# EAGLE design Adafruit EYESPI 1.44 inch TFT Breakout (EAGLE 9.6.2)
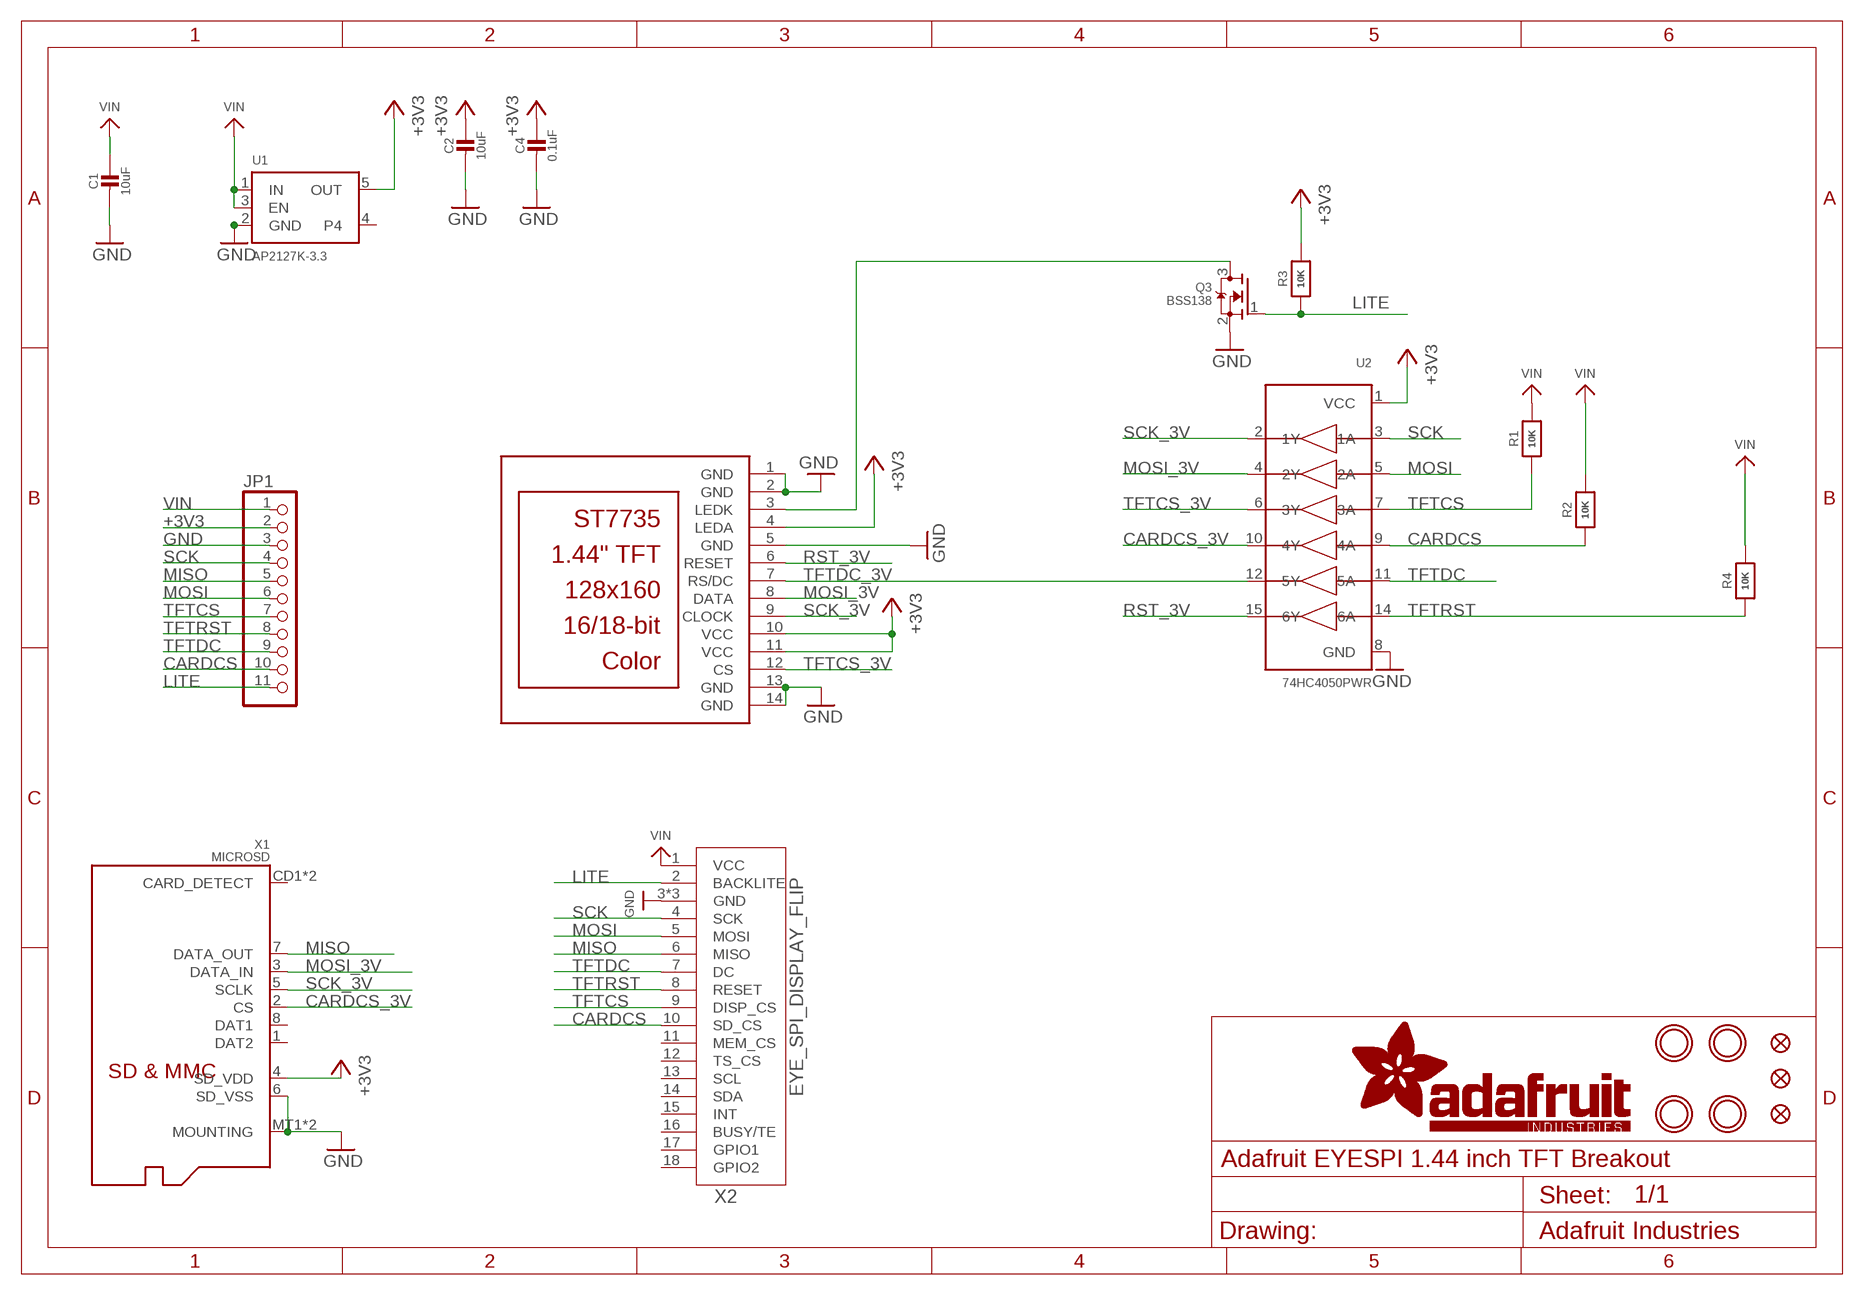
[diagram p0: schematic, sheet 1]

## Parts
C1  10uF  CAP_CERAMIC0805-NOOUTLINE  [0805-NO]
C2  10uF  CAP_CERAMIC0805-NOOUTLINE  [0805-NO]
C4  0.1uF  CAP_CERAMIC0603_NO  [0603-NO]
JP1  HEADER-1X1176MIL  [1X11_ROUND_76]
Q3  BSS138  MOSFET-NWIDE  [SOT23-WIDE]
R1  10K  RESISTOR_0603_NOOUT  [0603-NO]
R2  10K  RESISTOR_0603_NOOUT  [0603-NO]
R3  10K  RESISTOR_0603_NOOUT  [0603-NO]
R4  10K  RESISTOR_0603_NOOUT  [0603-NO]
TFT2  DISP_LCD_ST7735_1.44IN  [TFT_1.44IN_128_128]
U1  AP2127K-3.3  VREG_SOT23-5  [SOT23-5]
U2  74HC4050PWR  74HC4050DTSSOP  [TSSOP16]
U$3  FIDUCIAL_1MM  [FIDUCIAL_1MM]
U$4  FIDUCIAL_1MM  [FIDUCIAL_1MM]
U$5  FIDUCIAL_1MM  [FIDUCIAL_1MM]
U$7  MOUNTINGHOLE2.5  [MOUNTINGHOLE_2.5_PLATED]
U$8  MOUNTINGHOLE2.5  [MOUNTINGHOLE_2.5_PLATED]
U$9  MOUNTINGHOLE2.5  [MOUNTINGHOLE_2.5_PLATED]
U$10  MOUNTINGHOLE2.5  [MOUNTINGHOLE_2.5_PLATED]
X1  MICROSD  [MICROSD]
X2  EYE_SPI_DISPLAY_FLIP  [EYE_SPI_DISPLAY_BOTCONTACT]

## Nets
+3V3 [power]: C2.1 C4.1 JP1.2 R3.2 TFT2.4(LEDA) TFT2.10(VCC) TFT2.11(VCC) U1.5(OUT) U2.1(VCC) X1.4(SD_VDD)
CARDCS: JP1.10 R2.1 U2.9(4A) X2.10(SD_CS)
CARDCS_3V: U2.10(4Y) X1.2(CS)
GND: C1.2 C2.2 C4.2 JP1.3 Q3.2(S) TFT2.1(GND) TFT2.2(GND) TFT2.5(GND) TFT2.13(GND) TFT2.14(GND) U1.2(GND) U2.8(GND) X1.6(SD_VSS) X1.MT1(MOUNTING) X1.MT2(MOUNTING) X2.3(GND) X2.SUPPORT1(GND) X2.SUPPORT2(GND)
LITE: JP1.11 Q3.1(G) R3.1 X2.2(BACKLITE)
MISO: JP1.5 X1.7(DATA_OUT) X2.6(MISO)
MOSI: JP1.6 U2.5(2A) X2.5(MOSI)
MOSI_3V: TFT2.8(DATA) U2.4(2Y) X1.3(DATA_IN)
N$5: Q3.3(D) TFT2.3(LEDK)
RST_3V: TFT2.6(RESET) U2.15(6Y)
SCK: JP1.4 U2.3(1A) X2.4(SCK)
SCK_3V: TFT2.9(CLOCK) U2.2(1Y) X1.5(SCLK)
TFTCS: JP1.7 R1.1 U2.7(3A) X2.9(DISP_CS)
TFTCS_3V: TFT2.12(CS) U2.6(3Y)
TFTDC: JP1.9 U2.11(5A) X2.7(DC)
TFTDC_3V: TFT2.7(RS/DC) U2.12(5Y)
TFTRST: JP1.8 R4.1 U2.14(6A) X2.8(RESET)
VIN [power]: C1.1 JP1.1 R1.2 R2.2 R4.2 U1.1(IN) U1.3(EN) X2.1(VCC)
Unconnected: U1.4 X1.1(DAT2) X1.8(DAT1) X1.CD1(CARD_DETECT) X1.CD2(CARD_DETECT) X2.11(MEM_CS) X2.12(TS_CS) X2.13(SCL) X2.14(SDA) X2.15(INT) X2.16(BUSY/TE) X2.17(GPIO1) X2.18(GPIO2)

## Library data of the parts
C1 C2 C4 = microbuilder:CAP_CERAMIC: Ceramic Capacitors For new designs, use the packages preceded by an '_' character since they are more reliable: The following footprints should be used on most boards: _0402 - Standard footprint for regular board layouts _0603 - Standard footprint for regular board layouts _0805 - Standard footprint for regular board layouts _1206 - Standard footprint for regular board layouts For extremely tight-pitch boards where space is at a premium, the following 'micro-pitch' footprints can be used (smaller pads, no silkscreen outline, etc.): _0402MP - Micro-pitch footprint for very dense/compact boards _0603MP - Micro-pitch footprint for very dense/compact boards _0805MP - Micro-pitch footprint for very dense/compact boards _1206MP - Micro-pitch footprint for very dense/compact boards
JP1 = microbuilder:HEADER-1X11
Q3 = microbuilder:MOSFET-N: N-Channel Mosfet LEGEND VDS: Voltage Drain-Source ID: Drain Current RDS(ON): Drain-Source On-State Resistance VGS(TH): Gate-Source Threshold Voltage CISS: Drain-Source Input Capacitance SOT-23 Name VDS ID RDS(ON) VGS(TH) CISS Order Number 2N7002E 60V 260mA 2.5 Ohm 2.5V @ 250uA 26.7pF @ 25V 2N7002ET1GOSTR-ND BSH103 30V 850mA 400 mOhm 400mV @ 1mA 83pF @ 24V BSH103,235-ND BSS138 60V 320mA 1.6 Ohm 1.5V @ 250uA 50pF @ 10V Mouser: 771-BSS138PW115 DMN2075U-7 20V 4.2A 38 mOhm 1V @ 250 uA 594.3pF @ 10V DMN2075U-7DICT-ND * BSS138 good choice for I2C level-shifting POWERPAK 1212-8 Name VDS ID RDS(ON) VGS(TH) CISS Order Number Si7308DN 60V 6A 58 mOhm 3V @ 250uA 665pF @ 15V SI7308DN-T1-E3CT-ND
R1-R4 = microbuilder:RESISTOR: Resistors For new designs, use the packages preceded by an '_' character since they are more reliable: The following footprints should be used on most boards: _0402 - Standard footprint for regular board layouts _0603 - Standard footprint for regular board layouts _0805 - Standard footprint for regular board layouts _1206 - Standard footprint for regular board layouts For extremely tight-pitch boards where space is at a premium, the following 'micro-pitch' footprints can be used (smaller pads, no silkscreen outline, etc.): _0402MP - Micro-pitch footprint for very dense/compact boards _0603MP - Micro-pitch footprint for very dense/compact boards _0805MP - Micro-pitch footprint for very dense/compact boards _1206MP - Micro-pitch footprint for very dense/compact boards
TFT2 = adafruit_display:DISP_LCD_ST7735_1.44IN
U1 = adafruit_power:VREG_SOT23-5: SOT23-5 Fixed Voltage Regulators Part Current Out V Out V In V Dropout θJA (°C/W) TJ (°C) Digikey Part No. ADP121 150mA 3.3V 3.4-5.5V 0.09V @ 150mA -- -- ADP121-AUJZ33R7CT-ND ADP121 150mA 3.0V 3.1-5.5V 0.09V @ 150mA -- -- ADP121-AUJZ30R7CT-ND ADP122 300mA 3.3V 3.4-5.5V 0.085V @ 300mA -- -- ADP122AUJZ-3.3-R7CT-ND ADP1712 300mA 3.3V 3.5-5.5V 0.17V @ 300mA -- -- ADP1712AUJZ-3.3-R7TR-ND AP7311 (Low Cost) 150mA 3.3V 3.5-6V 0.15V @ 150mA -- -- AP7311-33WG-7DICT-ND LD39015M18R 150mA 1.8V 1.9V-5.5V 0.08V @ 100mA -- -- 497-6977-1-ND LP2985A-33DBVR 150mA 3.3V 3.3-16V 0.28V @ 150mA 206 150 296-18479-1-ND MCP1824T-3302E/OT 300mA 3.3V 3.5V-6V 0.2V @ 300mA -- -- MCP1824T-3302E/OTCT-ND MIC5205-2.5YM5 TR 150mA 2.5V 2.7-16V 0.165V @ 150mA -- -- 576-1257-2-ND MIC5205-3.0YM5 TR 150mA 3.0V 3.2V-16V 0.165V @ 150mA -- -- 576-1258-2-ND MIC5205-3.3YM5 TR 150mA 3.3V 3.5V-16V 0.165V @ 150mA -- -- 576-1259-2-ND TPS780330220 150mA 3.3V+2.2V 3.6-5.5V 250mV Max -- -- 296-23332-1-ND TDA3663/N1,135 100mA 3.3V 3.5-45V 0.18V @ 50mA -- -- 568-5343-1-ND Max operating temp can be calculated using θJA, TJ (max junction temperature), and power in watts. Set the "Maximum Ambient Temperature" until it reaches TJ ("Max Junction Temperature"), which is the absolute limit for safe use of the regulator: Heat Sink Temperature Calculator <http://www.daycounter.com/Calculators/Heat-Sink-Temperature-Calculator.phtml> For example, With 12V source into a 3.3V LP2985 and a 30mA load, we are dissipating (12V-3.3V) * 0.03A = 0.261W. With a θJA of 206 °C/W, a TJ of 150°C, and 261mW we can safely use the chip without a heat sink up to 75°C (=147.1°C Junction Temperature).; JLC_ROTATION: 270
U2 = microbuilder:74HC4050D: 6-channel level shifter 74HC4050D - 2V-6V Supply SOIC16 Digikey: 74HC4050D,653-ND Mouser: 771-74HC4050D-T TSSOP16 Digikey: 296-9215-1-ND Mouser:
U$3-U$5 = microbuilder:FIDUCIAL: Fiducial Alignment Points Various fiducial points for machine vision alignment.; BOM: EXCLUDE
U$7-U$10 = adafruit_electromech:MOUNTINGHOLE: Mounting Hole For #2 screws (0.086"/2.18mm width, 0.094"/2.4mm hole) use 2.5mm; BOM: EXCLUDE
X1 = adafruit_electromech:MICROSD: MicroSD/Transflash Card Holder with SPI pinout 3M: 2908-05WB-MG 4UConnector: 19656 Footprint courtesy: Adafruit Industries; JLC_ROTATION: 90; LCSC: C125617
X2 = adafruit_display:EYE_SPI_DISPLAY; LCSC: C2856802

## Net classes
1 power: width 0.254 mm

## Board
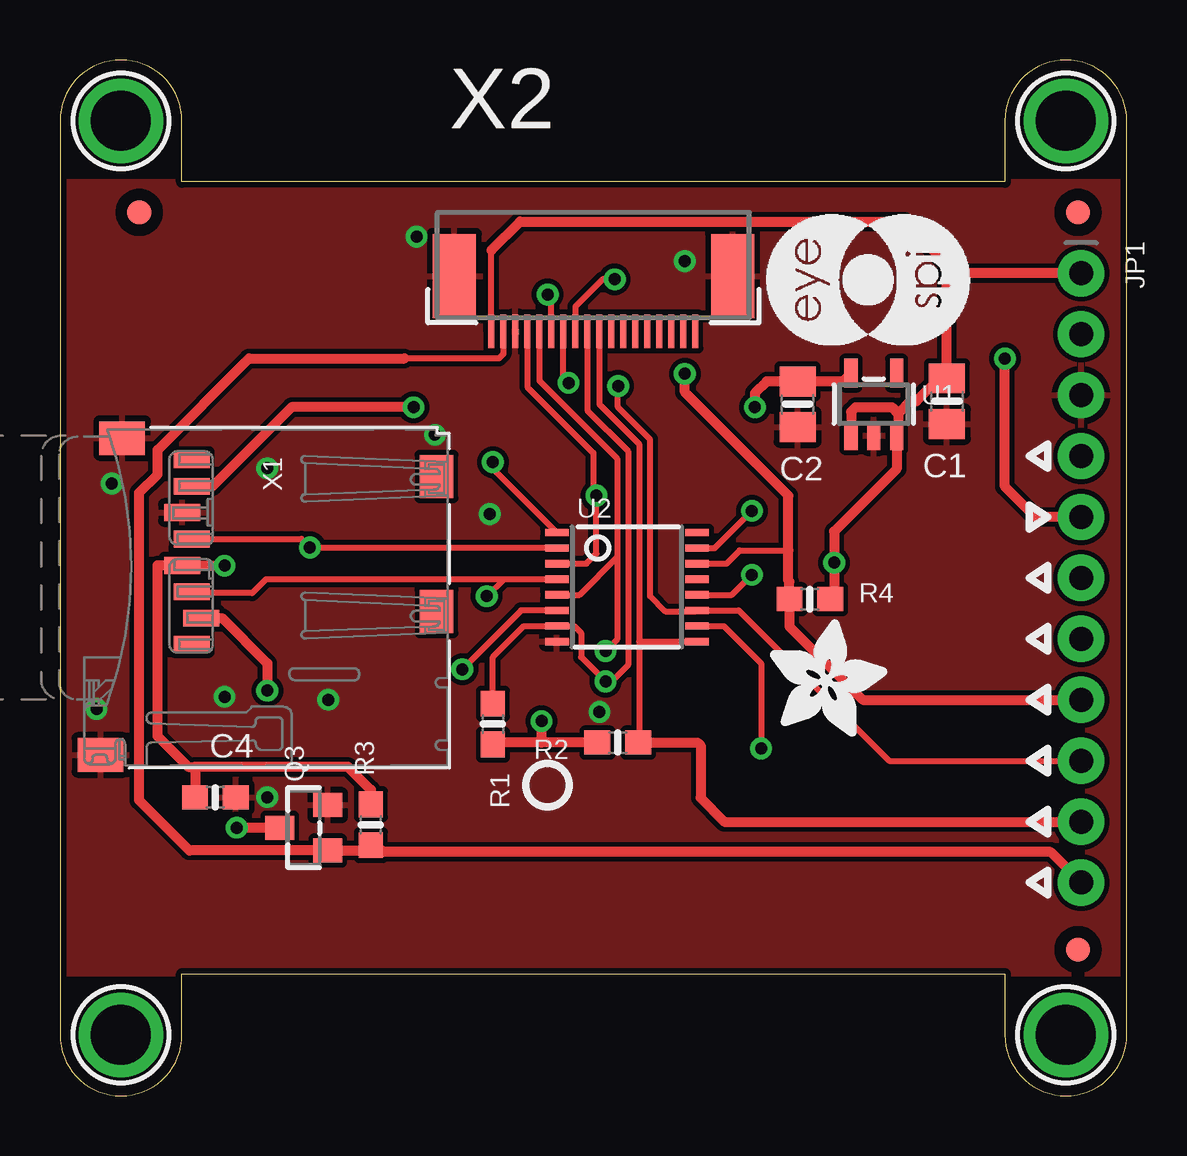
[diagram p1: board, top side]
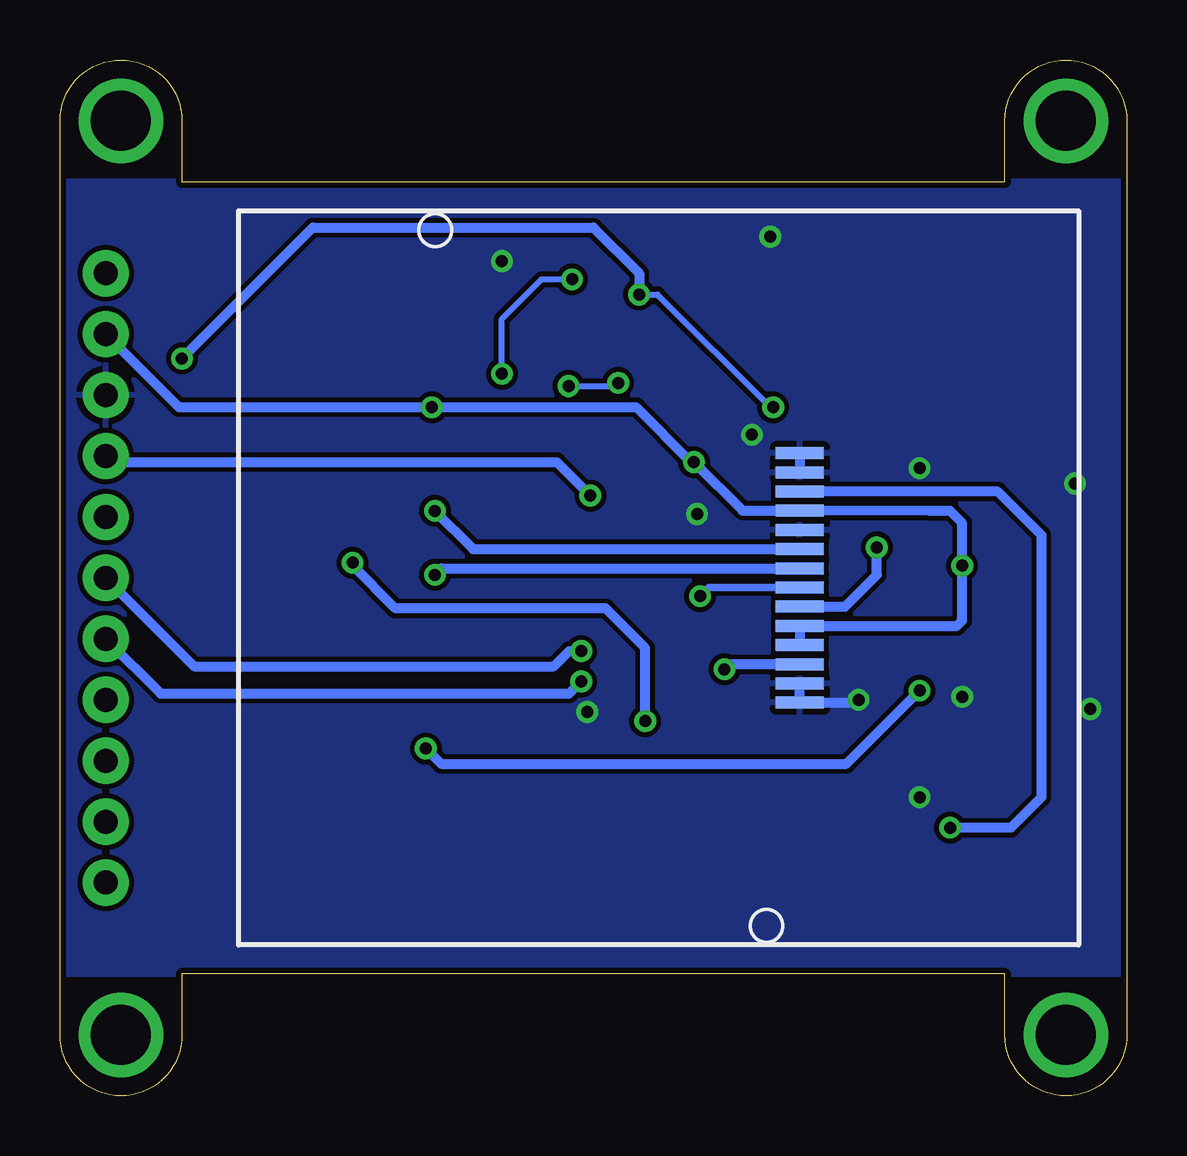
[diagram p2: board, bottom side, seen from below]

Size 44.45 x 43.18 mm. Coordinates in mm from the lower left corner, seen from the top.
Outline: 39.37,5.08 39.37,2.54 arc90 41.91,0 arc90 44.45,2.54 44.45,40.64 arc90 41.91,43.18 arc90 39.37,40.64 39.37,38.1 5.08,38.1 5.08,40.64 arc90 2.54,43.18 arc90 0,40.64 0,2.54 arc90 2.54,0 arc90 5.08,2.54 5.08,5.08 39.37,5.08
Copper layers (1*16): Top 0.035mm / dielectric 1.5mm / Bottom 0.035mm
Design rules "adafruit 8-8": minimum track width 6mil, minimum drill 15.5mil, track to track 8mil, track to pad 8mil, pad to pad 8mil, via to via 8mil, smd to smd 8mil, copper to edge 10mil, drill to drill 8mil, minimum pad ring 10mil, minimum via ring 8mil, stop-mask expansion 2mil, vias tented up to drill 20mil, thermal gap 10mil

### Footprints (pad centres in the part's own frame; a part is rotated, then mirrored left to right if it is on the bottom)
0805-NO = smd 1.24 x 1.5: 1 -0.95,0; 2 0.95,0
0603-NO = smd 1.075 x 1: 1 -0.85,0; 2 0.85,0
1X11_ROUND_76 = drill 1 pad 1.93: 1 -12.7,0; 2 -10.16,0; 3 -7.62,0; 4 -5.08,0; 5 -2.54,0; 6 0,0; 7 2.54,0; 8 5.08,0; 9 7.62,0; 10 10.16,0; 11 12.7,0
SOT23-WIDE = smd 1 x 1.2: 1 -0.95,-1; 2 0.95,-1; 3 0,1
TFT_1.44IN_128_128 = smd 0.5 x 2: 1 5.2,12.855; 2 4.4,12.855; 3 3.6,12.855; 4 2.8,12.855; 5 2,12.855; 6 1.2,12.855; 7 0.4,12.855; 8 -0.4,12.855; 9 -1.2,12.855; 10 -2,12.855; 11 -2.8,12.855; 12 -3.6,12.855; 13 -4.4,12.855; 14 -5.2,12.855
SOT23-5 = smd 0.55 x 1.2: 1 -0.95,-1.3; 2 0,-1.3; 3 0.95,-1.3; 4 0.95,1.3; 5 -0.95,1.3
TSSOP16 = smd 0.305 x 0.991: 1 -2.275,-2.918; 2 -1.625,-2.918; 3 -0.975,-2.918; 4 -0.325,-2.918; 5 0.325,-2.918; 6 0.975,-2.918; 7 1.625,-2.918; 8 2.275,-2.918; 9 2.275,2.918; 10 1.625,2.918; 11 0.975,2.918; 12 0.325,2.918; 13 -0.325,2.918; 14 -0.975,2.918; 15 -1.625,2.918; 16 -2.275,2.918
FIDUCIAL_1MM = smd 1 x 1: 1 0,0
MOUNTINGHOLE_2.5_PLATED = drill 2.5 pad 3.2: P$1 0,0
MICROSD = smd 0.7 x 1.5: 1 1.761,-3.147; 2 0.661,-2.747; 3 -0.439,-3.147; 4 -1.539,-3.547; 5 -2.639,-3.147; 6 -3.739,-3.547; 7 -4.839,-3.147; 8 -5.939,-3.147 | smd 1.8 x 1.4: CD1 -5.239,7.053; CD2 0.38,7.053 | smd 1.4 x 1.9: MT1 -6.839,-6.047; MT2 6.361,-6.947
EYE_SPI_DISPLAY_BOTCONTACT = smd 0.25 x 1.4: 1 4.25,1.154; 2 3.75,1.154; 3 3.25,1.154; 4 2.75,1.154; 5 2.25,1.154; 6 1.75,1.154; 7 1.25,1.154; 8 0.75,1.154; 9 0.25,1.154; 10 -0.25,1.154; 11 -0.75,1.154; 12 -1.25,1.154; 13 -1.75,1.154; 14 -2.25,1.154; 15 -2.75,1.154; 16 -3.25,1.154; 17 -3.75,1.154; 18 -4.25,1.154 | smd 1.8 x 3.5: SUPPORT1 -5.8,-1.152; SUPPORT2 5.8,-1.152

### Placement (x,y rotation side)
C1  36.96,28.96 270 top
C2  30.73,28.83 270 top
C4  6.48,12.45 0 top
JP1  42.55,21.59 270 top
PLABEL0  [PLABEL0]  39.37,33.91 0 top
PLABEL1  [PLABEL1]  35.81,16 0 top
PLABEL2  [PLABEL2]  37.72,13.46 0 top
PLABEL3  [PLABEL3]  33.66,10.92 0 top
PLABEL4  [PLABEL4]  34.92,18.54 0 top
PLABEL5  [PLABEL5]  36.58,21.08 0 top
PLABEL6  [PLABEL6]  37.34,26.29 0 top
PLABEL7  [PLABEL7]  36.58,23.62 0 top
PLABEL8  [PLABEL8]  37.21,8.38 0 top
PLABEL9  [PLABEL9]  2.67,28.32 0 top
PLABEL10  [PLABEL10]  17.02,10.16 0 top
PLABEL11  [PLABEL11]  17.02,7.87 0 top
PLABEL12  [PLABEL12]  0.76,5.97 0 top
PLABEL13  [PLABEL13]  16.89,5.71 0 top
PLABEL14  [PLABEL14]  38.86,28.83 0 top
PLABEL15  [PLABEL15]  38.61,31.24 0 top
PLABEL16  [PLABEL16]  41.15,34.29 0 bottom
PLABEL17  [PLABEL17]  41.15,31.75 0 bottom
PLABEL18  [PLABEL18]  41.15,29.21 0 bottom
PLABEL19  [PLABEL19]  41.15,26.67 0 bottom
PLABEL20  [PLABEL20]  41.15,24.13 0 bottom
PLABEL21  [PLABEL21]  41.15,21.59 0 bottom
PLABEL22  [PLABEL22]  41.15,19.05 0 bottom
PLABEL23  [PLABEL23]  41.15,16.51 0 bottom
PLABEL24  [PLABEL24]  41.15,13.97 0 bottom
PLABEL25  [PLABEL25]  41.15,11.43 0 bottom
PLABEL26  [PLABEL26]  41.15,8.89 0 bottom
Q3  10.16,11.18 90 top
R1  18.03,15.49 270 top
R2  23.24,14.73 180 top
R3  12.95,11.3 90 top
R4  31.24,20.7 0 top
TFT2  0.76,21.59 90 bottom
U1  33.91,28.83 0 top
U2  23.62,21.21 270 top
U$1  [ADAFRUIT_5MM]  29.59,14.99 0 top
U$2  [PCBFEAT-REV-040]  20.32,12.95 0 top
U$3  42.42,6.1 0 top
U$4  3.3,36.83 0 top
U$5  42.42,36.83 0 top
U$7  2.54,40.64 0 top
U$8  2.54,2.54 0 top
U$9  41.91,40.64 0 top
U$10  41.91,2.54 0 top
U$17  [EYESPI_MINI_LOGO]  37.97,31.24 90 top
X1  8.64,20.57 270 top
X2  22.23,33.02 180 top

### Tracks (layer width: path | path; a pad name or v marks a point on that pad's centre or on a via)
+3V3  (via drill 0.5)
  Top 0.254: U2.1 18.03,26.15 v18.03,26.42
  Top 0.406: v6.86,22.1 6.87,22.11 X1.4 4.06,22.11 4.06,14.99 5.33,13.72 5.62,13.72 | R3.2 12.95,12.76 12,13.72 5.62,13.72 | C4.1 5.63,13.71 5.62,13.72 | U1.5 | U1.5 32.61,29.78 C2.1 29.45,29.78 28.96,29.29 v28.96,28.7
  Bottom 0.406: TFT2.11 TFT2.10 7.08,19.59 6.86,19.81 v6.86,22.1 6.86,23.88 7.37,24.38 8.23,24.38 TFT2.4 16.01,24.39 v18.03,26.42 18.16,26.42 20.45,28.7 v28.96,28.7 39.5,28.7 JP1.2
CARDCS
  Top 0.254: X2.10 22.48,28.83 24.13,27.18 24.13,18.92 | R2.1 24.13,14.77 24.13,18.92 | U2.9 24.13,18.92
  Top 0.406: JP1.10 27.69,11.43 26.7,12.42 26.7,14.61 26.57,14.73 R2.1
CARDCS_3V  (via drill 0.5)
  Top 0.254: U2.10 27.66,19.58 29.21,18.03 v29.21,14.48
  Top 0.406: X1.2 6.76,19.91 8.64,18.03 v8.64,16.89
  Bottom 0.406: v8.64,16.89 11.68,13.84 28.57,13.84 v29.21,14.48
GND  (via drill 0.5)
  Bottom 0.406: TFT2.1 TFT2.2 | TFT2.13 TFT2.14 11.3,16.39 v11.18,16.51
  other vias: 8.64,26.16 8.64,12.45 6.86,16.64 17.91,24.26 22.48,16 2.16,25.53 1.52,16.13 14.86,35.81 26.04,34.8 15.62,27.56
  pour Top: 0,5.08 0,38.1 44.45,38.1 44.45,5.08
  pour Bottom: 44.45,5.08 0,5.08 0,38.1 44.45,38.1
LITE
  Top 0.254: X2.2 18.48,30.92 18.29,30.73 14.35,30.73
  Top 0.406: JP1.11 41.27,10.16 13.46,10.16 13.2,10.42 R3.1 12.72,10.22 12.71,10.23 Q3.1 5.39,10.23 3.3,12.32 3.3,25.15 4.06,25.91 4.06,26.92 7.87,30.73 14.35,30.73
MISO  (via drill 0.5)
  Top 0.254: X2.6 20.48,33.25 v20.32,33.4
  Top 0.406: X1.7 6.36,25.41 9.65,28.7 v14.73,28.7 | JP1.5 40.64,24.13 39.37,25.4 v39.37,30.73
  Bottom 0.254: v20.32,33.4 19.56,33.4 14.86,28.7 v14.73,28.7
  Bottom 0.406: v39.37,30.73 33.91,36.2 22.23,36.2 20.32,34.29 v20.32,33.4
MOSI  (via drill 0.5)
  Top 0.254: X2.5 19.98,29.81 23.22,26.57 23.22,22.45 | 23.22,22.45 21.65,20.88 U2.5 | 23.22,22.45 23.22,19.02 v22.73,18.54
  Bottom 0.406: JP1.6 38.86,17.91 23.88,17.91 23.24,18.54 v22.73,18.54
MOSI_3V  (via drill 0.5)
  Top 0.254: U2.4 18.49,21.53 | 18.49,21.53 v17.78,20.83 | 18.49,21.53 8.58,21.53 8,20.95 5.55,20.95 X1.3
  Bottom 0.305: 14.48,21.19 17.42,21.19 v17.78,20.83
  Bottom 0.406: TFT2.8 14.48,21.19
N$5  (via drill 0.5)
  Top 0.406: Q3.3 v7.37,11.18
  Bottom 0.406: TFT2.3 5.38,25.19 3.56,23.37 3.56,12.45 4.83,11.18 v7.37,11.18
RST_3V  (via drill 0.5)
  Top 0.254: U2.15 27.28,22.83 v28.83,24.38
  Bottom 0.406: v28.83,24.38 27.23,22.79 TFT2.6
SCK  (via drill 0.5)
  Top 0.254: X2.4 19.48,29.55 22.23,26.8 22.23,25.15 v22.35,25.02 22.35,22.61 21.93,22.18 U2.3
  Bottom 0.406: v22.35,25.02 23.75,26.42 42.29,26.42 JP1.4
SCK_3V  (via drill 0.5)
  Top 0.254: X1.5 10.06,23.21 v10.41,22.86 20.68,22.86 U2.2
  Bottom 0.406: v10.41,22.86 10.41,21.72 11.74,20.39 TFT2.9
TFTCS  (via drill 0.5)
  Top 0.254: X2.9 21.98,28.57 23.67,26.87 23.67,17.96 22.99,17.27 v22.73,17.27 21.72,18.29 21.72,19.3 21.44,19.58 U2.7 19.33,19.58 18.03,18.29 R1.1
  Bottom 0.406: JP1.7 40.26,16.76 23.24,16.76 v22.73,17.27
TFTCS_3V  (via drill 0.5)
  Top 0.254: U2.6 19.22,20.23 v16.76,17.78
  Bottom 0.406: v16.76,17.78 16.55,17.99 TFT2.12
TFTDC  (via drill 0.5)
  Top 0.254: v23.26,29.59 23.25,29.58 23.25,28.71 24.59,27.37 24.59,20.83 25.22,20.19 26.5,20.19 U2.11 28.28,20.23 34.54,13.97 JP1.9 | v21.19,29.72 20.98,29.94 X2.7
  Bottom 0.254: v23.26,29.59 21.32,29.59 v21.19,29.72
TFTDC_3V  (via drill 0.5)
  Top 0.254: U2.12 28,20.88 v28.83,21.72
  Bottom 0.406: v28.83,21.72 28.56,21.99 TFT2.7
TFTRST  (via drill 0.5)
  Top 0.254: v23.11,34.04 22.61,34.04 21.48,32.91 X2.8 | U2.14 27.77,22.18 28.32,22.73 30.35,22.73
  Top 0.406: JP1.8 33.46,16.51 30.39,19.57 R4.1 30.39,21.42 30.35,21.46 30.35,22.73 30.35,25.02 26.04,29.34 v26.04,30.1
  Bottom 0.254: v26.04,30.1 26.04,32.38 24.38,34.04 v23.11,34.04
VIN  (via drill 0.5)
  Top 0.254: X2.1 17.98,35.25
  Top 0.406: 34.92,28.45 34.67,28.7 33.15,28.7 32.96,28.51 U1.1 | 34.92,28.45 34.92,27.94 34.86,27.87 U1.3 34.86,26.13 32.26,23.53 v32.26,22.23 32.26,20.87 R4.2 | 34.92,28.45 35.43,28.96 35.69,28.96 36.58,29.84 36.9,29.84 C1.1 36.96,34.67 | R2.2 20.07,14.73 | 20.07,14.73 18.12,14.73 R1.2 | 20.07,14.73 v20.07,15.62 | 17.98,35.25 19.18,36.45 35.18,36.45 36.96,34.67 | JP1.1 37.34,34.29 36.96,34.67
  Bottom 0.406: v20.07,15.62 20.07,18.67 21.72,20.32 30.48,20.32 32.26,22.1 v32.26,22.23

### Text on the board
Pinguin_tBackup: Vin | 3.3V | Gnd | 1.44" 128x128 / ST7735 / TFT display / w/uSD card | SCK | MISO | MOSI | TFT_CS | RESET | D/C | CARD_CS | Power: 3.3-5V | LITE | Logic: 3.3-5V | from adafruit! | Backlite: PWM OK
Pinguin_bBackup: Vin | 3v3 | Gnd | SCK | SO | SI | TCS | RST | D/C | CCS | Lite